# Altium schematic sheet TIDA-010933-DCDC-Hardware.SchDoc
size 431 x 279 mm; Date: Not shown in title block; ApprovedBy: Not shown in title block; CheckedBy: Not shown in title block; Author: Not shown in title block; CompanyName: Not shown in title block; Engineer: Not shown in title block; Organization: Not shown in title block; Address1: Not shown in title block; Address2: Not shown in title block; Address3: Not shown in title block; Address4: Not shown in title block; DocumentNumber: 3; Revision: Use project parameter SCH_Rev; SheetNumber: 8; SheetTotal: 11; PageSetup: Record=PageOptions|CenterHorizontal=True|CenterVertical=True|PrintScale=1.00|XCorrection=1.00|YCorrection=1.00|PrintKind=0|BorderSize=5000000|LeftOffset=0|BottomOffset=0|Orientation=2|PaperLength=1000|PaperWidth=1000|Scale=100|PaperSource=15|PrintQuality=600|MediaType=1|DitherType=10|PaperKind=Letter|PrintScaleMode=1; CurrentTime: Not shown in title block; CurrentDate: Not shown in title block; Time: Not shown in title block; DocumentFullPathAndName: Not shown in title block; DocumentName: Not shown in title block; ModifiedDate: 1/25/2022; ImagePath: Not shown in title block
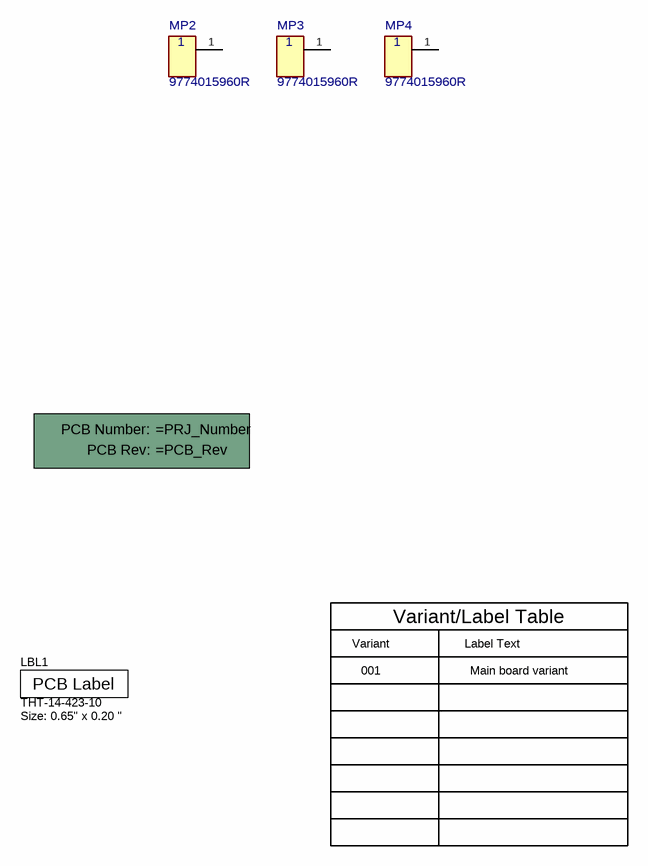
[diagram p0: TIDA-010933-DCDC-Hardware.SchDoc]

## Parts
!PCB2  Printed Circuit Board  (value not drawn)  (mechanical)
LBL1  THT-14-423-10  Note: Size: 0.65" x 0.20 "  [Label_650x200]
MP2  9774015960R  [FP-9774015960R_ROUND_SPACER_6MM0-MFG]
MP3  9774015960R  [FP-9774015960R_ROUND_SPACER_6MM0-MFG]
MP4  9774015960R  [FP-9774015960R_ROUND_SPACER_6MM0-MFG]

## Nets

Not connected (* = marked no-connect by the designer): MP2 1; MP3 1; MP4 1

## Notes on the sheet
- Variant
- Variant/Label Table
- Label Text
- 001
- Main board variant
- Drawn By:
- SVN Rev:
- Number:
- TID #:
- Orderable:
- Rev:
- Sheet Title:
- File:
- Project Title:
- Designed for:
- Assembly Variant:
- Mod. Date:
- Sheet:
- Size:
- of
- B
- http://www.ti.com
- Texas Instruments and/or its licensors do not warrant the accuracy or completeness of this specification or any information contained therein. Texas Instruments and/or its licensors do not warrant that this design will meet the specifications, will be suitable for your application or fit for any particular purpose, or will operate in an implementation. Texas Instruments and/or its licensors do not warrant that the design is production worthy. You should completely validate and test your design implementation to confirm the system functionality for your application.
- Engineer:
- Contact:
- © Texas Instruments
- (in symbol CMP-0003618-2) PCB Number:; PCB Rev:
- (in symbol CMP-0003625-1) PCB Label

## Library data of the parts
!PCB2 = CMP-0003618-2: Manufacturer: Any; CompType: PCB; PartNumber: =PRJ_Number; RoHS: O; MountType: N/A; Publisher: Texas Instruments; LatestRevisionDate: 2017-03-09; Key: PCB
LBL1 = CMP-0003625-1: Thermal Transfer Printable Labels, 0.650" W x 0.200" H - 10,000 per roll; Manufacturer: Brady; CompType: Label; ClassName: Label; PartNumber: THT-14-423-10; RoHS: Y; PackageReference: PCB Label 0.650 x 0.200 inch; MountType: N/A; ComponentLink1Description: Web Page; ComponentLink1URL: http://www.bradyid.com/bradyid/pdpv/THT-14-423-10.html; Publisher: Texas Instruments; LatestRevisionDate: 2017-03-09; Supplier 1: Newark; Supplier Part Number 1: 97C5133; Supplier 2: Farnell; Supplier Part Number 2: 2065596; Key: THT-14-423-10
MP2-MP4 = CMP-0040203-1: Round Spacer Unthreaded Steel 0.059" (1.50mm); Manufacturer: Wurth Electronics; AEC Qualified: No; Is Female: yes; SizeZ_mm: 1.6mm; PackageReference: ROUND_SPACER_6MM0; PartNumber: 9774015960R; RoHS: TRUE; Supplier 1: Digikey; Supplier 2: Mouser; Supplier Part Number 1: 732-7071-1-ND; Supplier Part Number 2: 710-9774015960R; Part Number: 9774015960R; datasheet: https://www.we-online.com/components/products/datasheet/9774015960R.pdf; Datasheet Path: datasheets/UNK-9774015960R.pdf; Digikey Description: ROUND SPACER STEEL 1.5MM; Digikey Part Number: 732-7071-1-ND; helpURL: https://upverter.com/upn/revision/67a23d837871b5d5/; Lead Free: Yes; Mouser Description: Spacer Material: Steel Mounting: SMT Series: WA-SMST For ø: 3.3 mm; Mouser Part Number: 710-9774015960R; Operating Temperature Range: -55°C to +150°C; ComponentLink1Description: Datasheet; ComponentLink1URL: https://www.we-online.com/components/products/datasheet/9774015960R.pdf